# Altium schematic sheet Analog_Front_End.SchDoc: Analog Front End
size A4; DrawnBy: T. Barrett; SheetNumber: 2; SheetTotal: 3
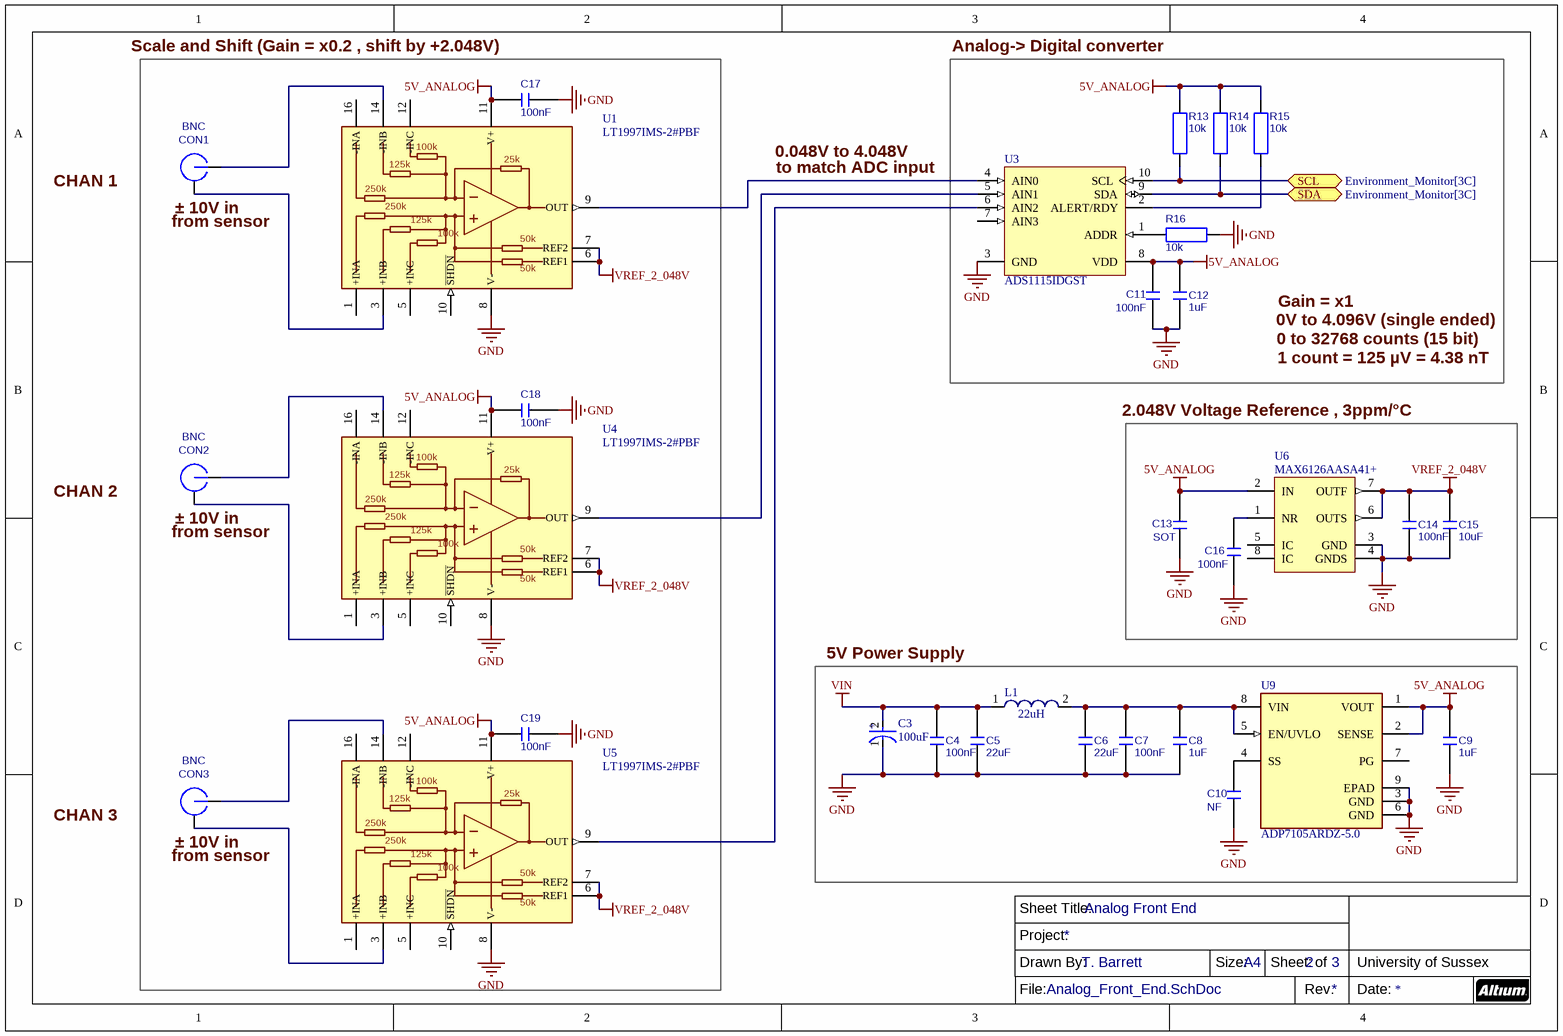
[diagram p0: Analog_Front_End.SchDoc]

## Parts
C3  100uF  [FP-865080657017-MFG]
C4  value 100nF  [CAPACITOR SMD 1206]  (hidden comment: Capacitor SMD 1206)
C5  value 22uF  [CAPACITOR SMD 1206]  (hidden comment: Capacitor SMD 1206)
C6  value 22uF  [CAPACITOR SMD 1206]  (hidden comment: Capacitor SMD 1206)
C7  value 100nF  [CAPACITOR SMD 1206]  (hidden comment: Capacitor SMD 1206)
C8  value 1uF  [CAPACITOR SMD 1206]  (hidden comment: Capacitor SMD 1206)
C9  value 1uF  [CAPACITOR SMD 1206]  (hidden comment: Capacitor SMD 1206)
C10  value NF  [CAPACITOR SMD 0805]  (hidden comment: Capacitor SMD 0805)
C11  value 100nF  [CAPACITOR SMD 0805]  (hidden comment: Capacitor SMD 0805)
C12  value 1uF  [CAPACITOR SMD 1206]  (hidden comment: Capacitor SMD 1206)
C13  value SOT  [CAPACITOR SMD 1206]  (hidden comment: Capacitor SMD 1206)
C14  value 100nF  [CAPACITOR SMD 0805]  (hidden comment: Capacitor SMD 0805)
C15  value 10uF  [CAPACITOR SMD 1206]  (hidden comment: Capacitor SMD 1206)
C16  value 100nF  [CAPACITOR SMD 0805]  (hidden comment: Capacitor SMD 0805)
C17  value 100nF  [CAPACITOR SMD 0805]  (hidden comment: Capacitor SMD 0805)
C18  value 100nF  [CAPACITOR SMD 0805]  (hidden comment: Capacitor SMD 0805)
C19  value 100nF  [CAPACITOR SMD 0805]  (hidden comment: Capacitor SMD 0805)
CON1  BNC  [BNC B6252H5-NPP3G-50]
CON2  BNC  [BNC B6252H5-NPP3G-50]
CON3  BNC  [BNC B6252H5-NPP3G-50]
L1  22uH  [WE-LQS 4018]
R13  value 10k  [RESISTOR SMD 0805]  (hidden comment: Resistor SMD 0805)
R14  value 10k  [RESISTOR SMD 0805]  (hidden comment: Resistor SMD 0805)
R15  value 10k  [RESISTOR SMD 0805]  (hidden comment: Resistor SMD 0805)
R16  value 10k  [RESISTOR SMD 0805]  (hidden comment: Resistor SMD 0805)
U1  LT1997IMS-2#PBF  [MSOP-16 (12 pin variation)]
U3  ADS1115IDGST  [VSSOP 10PIN]
U4  LT1997IMS-2#PBF  [MSOP-16 (12 pin variation)]
U5  LT1997IMS-2#PBF  [MSOP-16 (12 pin variation)]
U6  MAX6126AASA41+  [SOIC_N 8-pin]
U9  ADP7105ARDZ-5.0  [NSOIC-EP-8]

## Blocks framed on the sheet
2.048V Voltage Reference , 3ppm/°C: C13-C16 U6

## Ports
SCL (bidir, see Environment_Monitor[3C]), SDA (bidir, see Environment_Monitor[3C])

## Nets
5V_ANALOG: C9.2 C11.2 C12.2 C13.2 C17.2 C18.2 C19.2 R13.2 R14.2 R15.2 U1.11(V+) U3.8(VDD) U4.11(V+) U5.11(V+) U6.2(IN) U9.1(VOUT) U9.2(SENSE)
GND: C3.1(C) C4.1 C5.1 C6.1 C7.1 C8.1 C9.1 C10.1 C11.1 C12.1 C13.1 C14.1 C15.1 C16.1 C17.1 C18.1 C19.1 R16.1 U1.8(V-) U3.3(GND) U4.8(V-) U5.8(V-) U6.3(GND) U6.4(GNDS) U9.3(GND) U9.6(GND) U9.9(EPAD)
VIN: C3.2(A) C4.2 C5.2 L1.1
VREF_2_048V: C14.2 C15.2 U1.6(REF1) U1.7(REF2) U4.6(REF1) U4.7(REF2) U5.6(REF1) U5.7(REF2) U6.6(OUTS) U6.7(OUTF)
SCL: R13.1 U3.10(SCL) ; port SCL
SDA: R14.1 U3.9(SDA) ; port SDA
NetC6_2: C6.2 C7.2 C8.2 L1.2 U9.5(EN/UVLO) U9.8(VIN)
NetC10_2: C10.2 U9.4(SS)
NetC16_2: C16.2 U6.1(NR)
NetCON1_1: CON1.1 U1.14(-INB)
NetCON1_2: CON1.2 U1.3(+INB)
NetCON2_1: CON2.1 U4.14(-INB)
NetCON2_2: CON2.2 U4.3(+INB)
NetCON3_1: CON3.1 U5.14(-INB)
NetCON3_2: CON3.2 U5.3(+INB)
NetR15_1: R15.1 U3.2(ALERT/RDY)
NetR16_2: R16.2 U3.1(ADDR)
NetU1_9: U1.9(OUT) U3.4(AIN0)
NetU3_5: U3.5(AIN1) U4.9(OUT)
NetU3_6: U3.6(AIN2) U5.9(OUT)

Not connected (* = marked no-connect by the designer): CON1 3 4; CON2 3 4; CON3 3 4; U1 1(+INA) 5(+INC) 10(~{SHDN}) 12(-INC) 16(-INA); U3 7(AIN3); U4 1(+INA) 5(+INC) 10(~{SHDN}) 12(-INC) 16(-INA); U5 1(+INA) 5(+INC) 10(~{SHDN}) 12(-INC) 16(-INA); U6 5(IC) 8(IC); U9 7(PG)

## Notes on the sheet
- (near C17) Scale and Shift (Gain = x0.2 , shift by +2.048V)
- Analog-> Digital converter
- CHAN 1
- 0.048V to 4.048V
- to match ADC input
- (near CON1) ± 10V in
- (near CON1) from sensor
- Gain = x1
- 0V to 4.096V (single ended)
- 0 to 32768 counts (15 bit)
- 1 count = 125 µV = 4.38 nT
- CHAN 2
- (near CON2) ± 10V in
- (near CON2) from sensor
- 5V Power Supply
- CHAN 3
- (near CON3) ± 10V in
- (near CON3) from sensor
- Sheet Title:
- Drawn By:
- Project:
- Size:
- A4
- Sheet:
- of
- University of Sussex
- File:
- Rev.
- Date:
- (in symbol CMP-207834-000015-1) +
- (in symbol LT1997-2) 100k; 25k; 125k; 250k; 50k

## Library data of the parts
C3 = CMP-207834-000015-1: CAP ALUM 150UF 20% 50V SMD; Polarity: Polar; Ripple Current: 600mA; Life (Hours): 2000Hour; Impedance: 250mR; Voltage Rating (DC): 50V; Capacitance: 150uF; Tolerance: 20%; Diameter: 10mm; Max Operating Temperature: 105°C; Height: 10.5mm; Height - Seated (Max): 0.413inch; Series: WCAP-ASLI; Package Quantity: 1; Voltage Rating: 50V; Packaging: Cut Tape; Case/Package: Radial; Mount: Surface Mount; Min Operating Temperature: -55°C; RoHS Compliant: Yes; Ripple Current (AC): 600mA
C4-C9 C12 C13 C15 = Capacitor SMD 1206: Ceramic chip capacitor 1206
C10 C11 C14 C16-C19 = Capacitor SMD 0805: Ceramic chip capacitor 0805
CON1-CON3 = BNC B6252H5-NPP3G-50: AMPHENOL B6252H5-NPP3G-50  RF / Coaxial Connector, BNC Coaxial, Right Angle Jack, Through Hole Right Angle, 50 ohm; Value: *
L1 = CMP-1354-00031-1: WE-LQS SMD Power Inductor, L=33 µH; Manufacturer: Wuerth Elektronik; PartNumber: 74404042330; Inductance: 33 ÂµH; ComponentLink1URL: http://www.we-online.com; ComponentLink1Description: Manufacturer URL; ComponentLink2Description: Datasheet; PackageReference: WE-LQS 4018; ComponentLink2URL: http://katalog.we-online.de/pbs/datasheet/74404042330.pdf
R13-R16 = Resistor SMD 0805: Resistor, SMD, 0805
U1 U4 U5 = LT1997-2: IC OPAMP GP 1 CIRCUIT 16MSOP; RoHS Compliant: Yes
U3 = ADS1115: TEXAS INSTRUMENTS 16-Bit ADC with Integrated Multiplexer, PGA, Comparator, Oscillator, and Reference, -40 to 125 degC, 10-pin SOP (DGS10), Green (RoHS & no Sb/Br); Sample Rate (max)(SPS): 860; SubFamily: Precision ADC (<=10MSPS); Architecture: Delta-Sigma; Digital Supply(Min)(V): 2; Resolution(Bits): 16; Digital Supply(Max)(V): 5.5; INL(Max)(+/-LSB): 1; Interface: Serial I2C; # Input Channels: 4; Eco-Plan: Green (RoHS & no Sb/Br); PackageDescription: 10-Pin Plastic Small Outline, Body 3 x 3 mm, Pitch 0.5 mm; Mounting Technology: Surface Mount; PackageReference: DGS10; DatasheetVersion: SBAS444B; ComponentLink3Description: Package Specification; ComponentLink1Description: Manufacturer URL; PartNumber: ADS1115IDGST; Manufacturer: Texas Instruments; ComponentLink3URL: http://www.ti.com/lit/ml/mpds035b/mpds035b.pdf; ComponentLink2URL: http://www.ti.com/general/docs/lit/getliterature.tsp?genericPartNumber=ADS1115&fileType=pdf; Analog Voltage AV/DD(Min)(V): 2; ComponentLink2Description: Datasheet; PackageVersion: 4073272/C, 02/2004; Analog Voltage AV/DD(Max)(V): 5.5; Code_JEDEC: MO-153; ComponentLink1URL: http://www.ti.com/
U6 = MAX6126: Ultra-High-Precision, Ultra-Low-Noise, Series Voltage Reference, 8-Pin SOIC; Manufacturer: Maxim; Output Voltage Accuracy: 0.02% Max.; Line Regulation: 60 uV/V Max.; VOUT: 4.096 V; Dropout Voltage@10 mA: 0.1 V Typ.; Packing: Tube; VIN: 4.3 to 12.6 V; Operating Temperature: -40 to 125 degC; ComponentLink3URL: http://pdfserv.maximintegrated.com/package_dwgs/21-0041.PDF; PartNumber: MAX6126AASA41+; RoHS: TRUE; ComponentLink3Description: Package Specification; ComponentLink1URL: http://www.maximintegrated.com/; Mounting Technology: Surface Mount; DatasheetVersion: Rev. 6; ComponentLink1Description: Manufacturer URL; ComponentLink2URL: http://datasheets.maximintegrated.com/en/ds/MAX6126.pdf; PackageDescription: 8-Pin Small Outline Integrated Circuit Package, Body 4.9 x 3.9 mm, Pitch 1.27 mm; ComponentLink2Description: Datasheet; PackageVersion: Rev. E
U9 = ADP7105: ANALOG DEVICES 20 V, 500 mA, Low Noise LDO Regulator; Max Supply Current: 900uA; Output Current: 500mA; Polarity: Positive; Number of Regulators: 1; Min Output Voltage: 1.22V; Dropout Voltage: 350mV; Output Voltage Accuracy: 0.8%; Power Supply Rejection Ratio (PSRR): 50dB; Input Bias Current: 10nA; Reference Voltage: 1.23V; Max Input Voltage: 20V; Min Current Limit: 625mA; Nominal Output Voltage: 5V; Min Input Voltage: 3.3V; Max Output Voltage: 19V; Output Type: Fixed; RoHS Compliant: Yes; Package Quantity: 98; Number of Pins: 8; Mount: Surface Mount; Number of Outputs: 1; Contact Plating: Tin; Quiescent Current: 900uA; Width: 4mm; Height: 1.65mm; Lead Free: Contains Lead; Accuracy: 0.8%; Max Operating Temperature: 125°C; Length: 5mm; Packaging: Rail/Tube; REACH SVHC: No SVHC; Min Operating Temperature: -40°C; Case/Package: SOIC; Output Voltage: 5V; Max Output Current: 500mA